# EAGLE design Dirth_Rims_Mend_Orca (EAGLE 9.6.2)
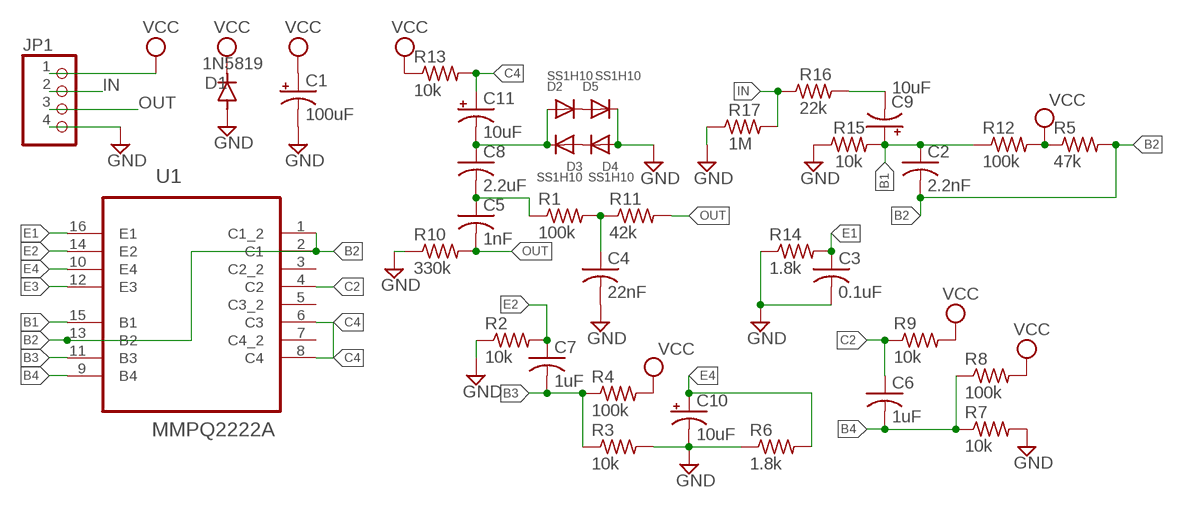
[diagram p0: schematic, sheet 1]

## Parts
C1  100uF  CAP_SMD+THRUPAN_B  [PAN_B_SMD+THRU]
C2  2.2nF  C-USC0603  [C0603]
C3  0.1uF  C-USC0603  [C0603]
C4  22nF  C-USC0603  [C0603]
C5  1nF  C-USC0603  [C0603]
C6  1uF  C-USC0603  [C0603]
C7  1uF  C-USC0603  [C0603]
C8  2.2uF  C-USC0603  [C0603]
C9  10uF  CAP_SMD+THRUPAN_B  [PAN_B_SMD+THRU]
C10  10uF  CAP_SMD+THRUPAN_B  [PAN_B_SMD+THRU]
C11  10uF  CAP_SMD+THRUPAN_B  [PAN_B_SMD+THRU]
D1  1N5819  DIODE-SOD123  [SOD123]
D2  SS1H10  DIODESMA  [SMADIODE]
D3  SS1H10  DIODESMA  [SMADIODE]
D4  SS1H10  DIODESMA  [SMADIODE]
D5  SS1H10  DIODESMA  [SMADIODE]
JP1  PINHD-1X4  [1X04]
R1  100k  R-US_R0603  [R0603]
R2  10k  R-US_R0603  [R0603]
R3  10k  R-US_R0603  [R0603]
R4  100k  R-US_R0603  [R0603]
R5  47k  R-US_R0603  [R0603]
R6  1.8k  R-US_R0603  [R0603]
R7  10k  R-US_R0603  [R0603]
R8  100k  R-US_R0603  [R0603]
R9  10k  R-US_R0603  [R0603]
R10  330k  R-US_R0603  [R0603]
R11  42k  R-US_R0603  [R0603]
R12  100k  R-US_R0603  [R0603]
R13  10k  R-US_R0603  [R0603]
R14  1.8k  R-US_R0603  [R0603]
R15  10k  R-US_R0603  [R0603]
R16  22k  R-US_R0603  [R0603]
R17  1M  R-US_R0603  [R0603]
U1  MMPQ2222A  [SOIC127P600X175-16N]

## Nets
B1: C2.1 C9.+ C9.++(+) R12.1 R15.2 U1.15(B1)
B2: C2.2 R5.2 U1.1(C1_2) U1.2(C1) U1.13(B2)
B3: C7.2 R3.1 R4.1 U1.11(B3)
B4: C6.2 R7.1 R8.1 U1.9(B4)
C2: C6.1 R9.1 U1.4(C2)
C4: C11.+ C11.++(+) R13.2 U1.6(C3) U1.8(C4)
E1: C3.1 R14.2 U1.16(E1)
E2: C7.1 R2.2 U1.14(E2)
E3: U1.12(E3)
E4: C10.+ C10.++(+) R6.2 U1.10(E4)
GND: C1.- C1.--(-) C3.2 C4.2 C10.- C10.--(-) D1.A D4.A D5.C JP1.4 R2.1 R3.2 R6.1 R7.2 R10.1 R14.1 R15.1 R17.1
IN: JP1.2 R16.1 R17.2
N$1: C9.- C9.--(-) R16.2
N$2: C8.1 C11.- C11.--(-) D2.A D3.C
N$3: C5.1 C8.2 R1.1
N$4: D3.A D4.C
N$5: D2.C D5.A
N$6: C4.1 R1.2 R11.1
OUT: C5.2 JP1.3 R10.2 R11.2
VCC: C1.+ C1.++(+) D1.C JP1.1 R4.2 R5.1 R8.2 R9.2 R12.2 R13.1
Unconnected: U1.3(C2_2) U1.5(C3_2) U1.7(C4_2)

## Library data of the parts
C1 C9-C11 = MusicThingModular:CAP_SMD+THRU
C2-C8 = adafruit:C-US: CAPACITOR, American symbol
D1 = diode:DIODE-: DIODE
D2-D5 = adafruit:DIODE: Diode SMADIODE - SMA Surface Mount Package 20V 1A Schottky Diode Digikey: 641-1014-6-ND DO-1N4148 - Through Hole Small Current Diode SOD-123 20V 1 A (.5mV Vf) Schottky Diode - Digikey: MBRX120TPMSCT-ND SOD-323 10V 570mA (.38mV Vf, 3ns) Schottky Diode - Digikey: ZLLS410CT-ND SOD-523 30V 30mA Schottky Diode (RB751S-40TE61) - Digikey: RB751S-40TE61CT-ND SOT23-R/W - SOT23 Package (R = Solder Paste/Reflow Ovens, W = Hand-Soldering) BAT54Film 40V 300mA - Digikey: 497-7162-1-ND
JP1 = Connector:PINHD-1X4: PIN HEADER; CATEGORY: CONNECTOR; SUB-CATEGORY: PIN-HEADER
R1-R17 = adafruit:R-US_: RESISTOR, American symbol
U1 = MMPQ2222A:MMPQ2222A: NPN Multi-Chip General Purpose Amplifier Check prices <https://pricing.snapeda.com/search/part/MMPQ2222A/?ref=eda>; AVAILABILITY: Good; DESCRIPTION: Bipolar (BJT) Transistor Array 4 NPN (Quad) 40V 500mA 300MHz 1W Surface Mount 16-SOIC; MF: ON Semiconductor; MP: MMPQ2222A; PACKAGE: SOIC-16 ON Semiconductor; PRICE: None; PURCHASE-URL: https://pricing.snapeda.com/search/part/MMPQ2222A/?ref=eda

## Board
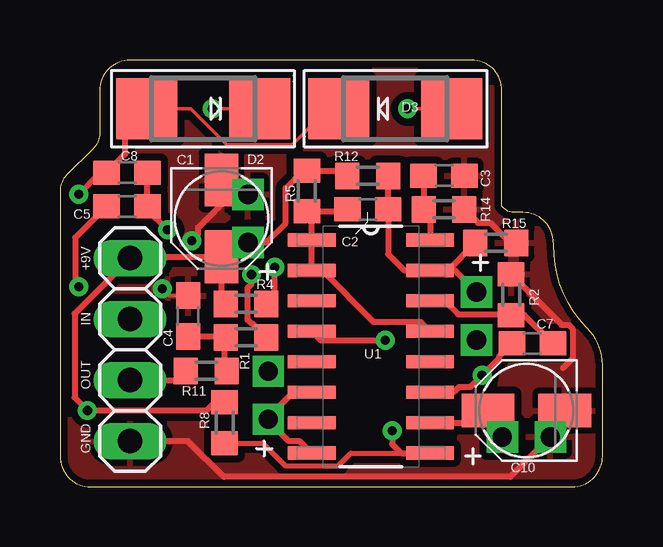
[diagram p1: board, top side]
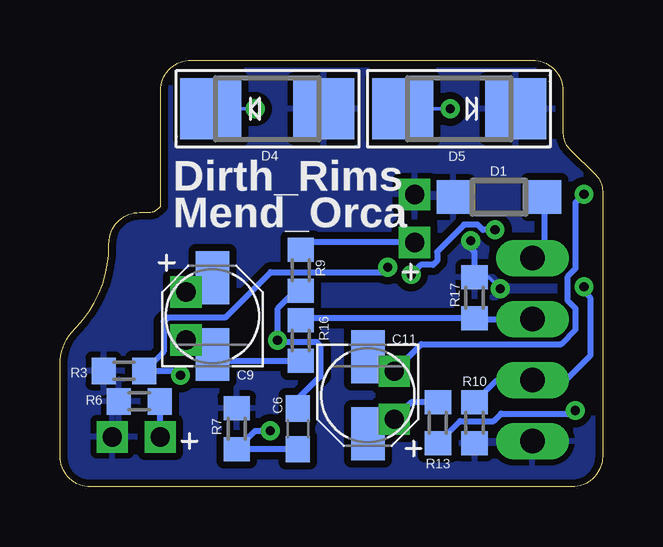
[diagram p2: board, bottom side, seen from below]

Size 22.61 x 17.78 mm. Coordinates in mm from the lower left corner, seen from the top.
Outline: 22.61,5.08 arc45 21.98,6.6 21.91,6.66 arc-45 20.57,10.07 20.55,10.28 arc85 19.29,11.43 18.92,11.43 arc-45 18.49,11.61 18.41,11.68 18.41,16.51 arc90 17.14,17.78 2.92,17.78 arc90 1.65,16.51 1.65,14.73 arc-45 1.38,14.08 0.27,12.97 arc45 0,12.32 0,1.27 arc90 1.27,0 21.34,0 arc90 22.61,1.27 22.61,5.08
Copper layers (1*16): Top 0.035mm / dielectric 1.5mm / Bottom 0.035mm
Design rules "default *": minimum track width 6mil, minimum drill 0.35mm, track to track 6mil, track to pad 6mil, pad to pad 6mil, via to via 6mil, smd to smd 6mil, copper to edge 10mil, drill to drill 6mil, minimum pad ring 10mil, minimum via ring 8mil, stop-mask expansion 4mil, vias tented up to drill 0mil, thermal gap 10mil

### Footprints (pad centres in the part's own frame; a part is rotated, then mirrored left to right if it is on the bottom)
PAN_B_SMD+THRU = smd 2.2 x 1.4: + 1.6,0; - -1.6,0 | drill 0.8 pad 0.9 square: ++ 1,1.1; -- -1,1.1
C0603 = smd 1.1 x 1: 1 -0.85,0; 2 0.85,0
SOD123 = smd 1.4 x 1.4: A 1.9,0; C -1.9,0
SMADIODE = smd 2.54 x 2.54: A 2.349,0; C -2.349,0
1X04 = drill 1.016 long: 1 -3.81,0; 2 -1.27,0; 3 1.27,0; 4 3.81,0
R0603 = smd 1 x 1.1: 1 -0.85,0; 2 0.85,0
SOIC127P600X175-16N = smd 1.981 x 0.559: 1 -2.464,4.445; 2 -2.464,3.175; 3 -2.464,1.905; 4 -2.464,0.635; 5 -2.464,-0.635; 6 -2.464,-1.905; 7 -2.464,-3.175; 8 -2.464,-4.445; 9 2.464,-4.445; 10 2.464,-3.175; 11 2.464,-1.905; 12 2.464,-0.635; 13 2.464,0.635; 14 2.464,1.905; 15 2.464,3.175; 16 2.464,4.445

### Placement (x,y rotation side)
C1  6.73,11.18 270 top
C2  12.83,11.56 180 top
C3  16,12.95 0 top
C4  5.33,7.11 90 top
C5  2.79,11.68 180 top
C6  12.7,2.41 270 bottom
C7  19.68,5.97 180 top
C8  2.79,13.08 0 top
C9  16.26,7.11 90 bottom
C10  19.43,3.17 180 top
C11  9.78,3.81 270 bottom
D1  4.32,12.06 180 bottom
D2  5.97,15.75 180 top
D3  13.97,15.75 0 top
D4  13.97,15.75 0 bottom
D5  5.97,15.75 180 bottom
JP1  2.92,5.71 270 top
R1  7.75,6.22 180 top
R2  18.8,8 270 top
R3  19.94,4.83 180 bottom
R4  7.75,7.62 180 top
R5  10.29,12.32 270 top
R6  19.3,3.56 0 bottom
R7  15.24,2.41 90 bottom
R8  6.86,2.67 90 top
R9  12.57,9.02 90 bottom
R10  5.33,2.67 90 bottom
R11  6.1,4.83 180 top
R12  12.83,12.95 180 top
R13  6.86,2.67 90 bottom
R14  16,11.56 180 top
R15  18.16,10.16 180 top
R16  12.57,6.1 270 bottom
R17  5.33,7.87 270 bottom
U1  12.95,5.84 0 top

### Tracks (layer width: path | path; a pad name or v marks a point on that pad's centre or on a via)
B1
  Top 0.254: U1.15 14.35,9.02 13.68,9.69 C2.1 R12.1 | U1.15 16.17,9.02 R15.2 | U1.15 16.45,9.02 C9.++
  Bottom 0.254: C9.++ 16.86,8.11 C9.+
B2
  Top 0.254: U1.13 15.04,6.86 13.08,6.86 10.92,9.02 U1.2 U1.1 10.49,11.27 R5.2 11.89,11.47 C2.2
B3  (via drill 0.38)
  Top 0.254: C7.2 18.29,5.42 18.29,5.34 v17.59,4.64 17.1,4.15 16.61,4.15 16.4,3.94 U1.11 | R4.1 8.95,7.98 v8.95,9.14
  Bottom 0.254: v17.59,4.64 17.77,4.83 R3.1 18.29,5.63 18.29,6.88 18.13,7.04 15.73,7.04 13.83,8.95 9.15,8.95 v8.95,9.14
B4  (via drill 0.38)
  Top 0.203: R8.1 8.44,1.82 9.39,0.86 11.59,0.86 12.12,1.4 14.22,1.4
  Top 0.254: v13.84,2.33 13.84,1.78 14.22,1.4 U1.9
  Bottom 0.254: C6.2 R7.1 14.47,2.33 v13.84,2.33
C2  (via drill 0.38)
  Top 0.254: U1.4 10.87,6.1 v13.54,6.1
  Bottom 0.254: R9.1 12.8,8.17 13.53,7.43 13.53,6.11 v13.54,6.1 13.47,6.03 11.91,6.03 11.74,5.86 11.74,4.63 12.7,3.67 C6.1
C4
  Top 0.254: U1.8 9.98,1.91 9.53,1.91 8.68,2.75 C11.++ 8.68,2.9 9.71,3.94 U1.6
  Bottom 0.152: C11.++ 9.28,2.21 C11.+
  Bottom 0.254: R13.2 7.97,3.52 C11.++
E1
  Top 0.254: C3.1 R14.2 15.42,11.29 U1.16
E2
  Top 0.254: U1.14 16.02,7.75 16.59,7.18 18.77,7.18 R2.2 19.35,7.15 C7.1
E4
  Top 0.254: U1.10 17.32,2.67 C10.+ 18.43,2.58 C10.++
  Bottom 0.254: C10.++ 18.43,3.53 R6.2
GND  (via drill 0.38)
  Top 0.152: C4.2 4.56,7.96 v4.26,8.26 | C1.- 7.33,12.18 C1.--
  Top 0.254: v5.49,10.25 5.75,10.52 5.75,10.79 6.73,11.77 C1.- | R14.1 17.42,10.99 17.93,10.99 18.76,10.16 R15.1 | C10.- 21.03,2.67 C10.-- 18.76,0.41 6.82,0.41 5.33,1.91 JP1.4 | R2.1 20.9,6.75 21.2,6.75 21.36,6.58 21.36,5.35 20.95,4.94
  Bottom 0.152: v4.26,8.26 4.73,8.72 R17.1
  Bottom 0.254: R17.1 5.33,9.78 5.59,10.03 5.59,10.15 v5.49,10.25
  pour Top (isolate 0.305): -1.14,23.37 -1.14,-0.76 22.99,-0.76 22.99,23.37
  pour Bottom (isolate 0.305): -1.14,23.37 -1.14,-0.76 22.99,-0.76 22.99,23.37
IN
  Bottom 0.254: R16.1 12.49,7.02 R17.2 5.29,6.99 JP1.2
N$1
  Bottom 0.254: C9.-- 16.76,5.51 C9.- 15.99,5.25 R16.2
N$2  (via drill 0.38)
  Top 0.152: D3.C 11.18,15.75 9.68,14.25 6.95,14.25 5.46,15.75 D2.A
  Top 0.254: D2.A 2.71,14.84 2.71,13.84 C8.1 1.66,13.08 v0.78,12.19
  Bottom 0.254: C11.- 9.28,5.41 C11.-- 7.54,5.94 1.73,5.94 1.12,6.55 1.12,7.42 1.45,7.75 1.45,8.76 1.12,9.09 1.12,11.85 v0.78,12.19
N$3  (via drill 0.38)
  Top 0.254: R1.1 8.03,6.79 7.98,6.79 7.82,6.95 7.82,8.29 7.98,8.45 v7.98,8.84 | v4.48,10.7 3.64,11.54 C5.1 C8.2
  Bottom 0.254: v4.48,10.7 4.99,10.7 5.21,10.92 5.76,10.92 6.9,9.79 6.9,9.41 7.06,9.24 7.58,9.24 v7.98,8.84
N$4  (via drill 0.38)
  Top 0.152: v14.48,15.75 D4.C
  Bottom 0.152: D4.C v14.48,15.75
N$5  (via drill 0.38)
  Top 0.152: D5.A v6.35,15.75
  Bottom 0.152: v6.35,15.75 D5.A
N$6
  Top 0.254: C4.1 6.86,6.26 | 6.86,6.26 R1.2 | R11.1 6.86,4.91 6.86,6.26
OUT  (via drill 0.38)
  Top 0.254: JP1.3 4.87,4.45 R11.2 | C5.2 0.64,10.38 0.64,8.47 v0.78,8.33
  Bottom 0.254: R10.2 4.45,4.41 2.96,4.41 | 2.96,4.41 JP1.3 | v0.78,8.33 0.78,8.13 0.52,7.87 0.52,5.45 1.65,4.32 2.87,4.32 2.96,4.41
VCC  (via drill 0.38)
  Top 0.254: C1.+ 7.23,9.58 C1.++ 8.59,10.18 9.4,10.98 9.4,12.45 10.12,13.17 R5.1 11.76,13.17 R12.2 | R8.2 6.44,3.52 6.1,3.17 v1.14,3.17 0.61,3.71 0.61,7.21 JP1.1 2.97,9.58 C1.+ | R4.2 6.73,7.79 C1.+
  Bottom 0.254: JP1.1 2.42,10.03 D1.C | C1.++ 12.26,10.18 R9.2 | R13.1 5.94,2.74 4.54,2.74 4.23,3.05 1.27,3.05 v1.14,3.17

### Text on the board
tPlace: +9V | IN | OUT | GND
bPlace: Dirth_Rims | Mend_Orca